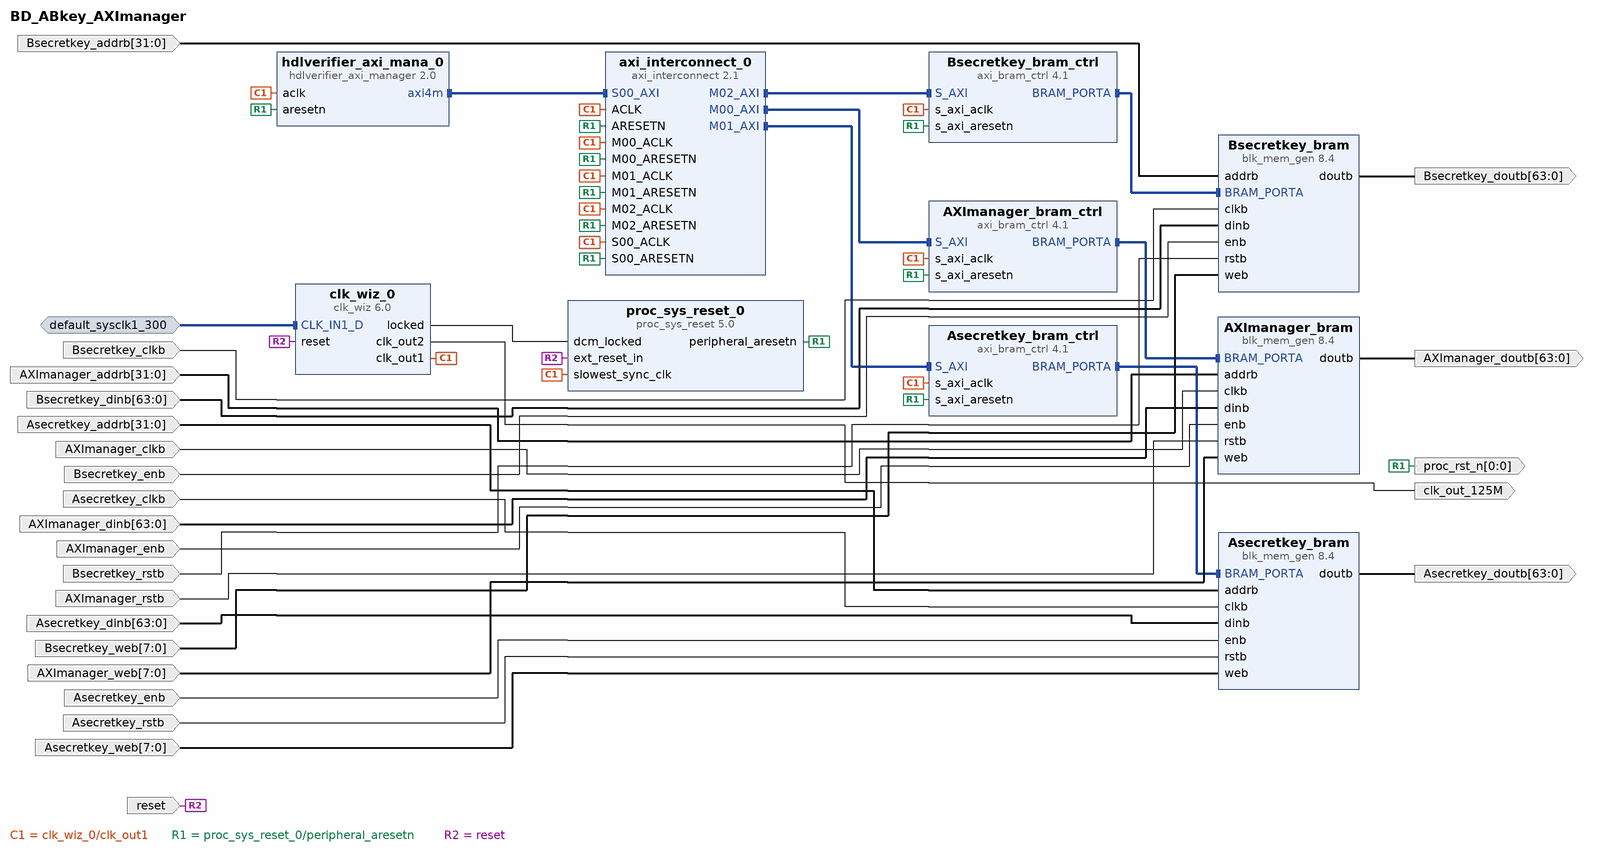
[diagram p0: block diagram of the top level]
# Vivado block design BD_ABkey_AXImanager, xcku5p-ffvb676-2-e, Vivado 2022.1
create_bd_design BD_ABkey_AXImanager

create_bd_intf_port -mode Slave -vlnv xilinx.com:interface:diff_clock_rtl:1.0 default_sysclk1_300
set_property -dict {CONFIG.FREQ_HZ 300000000} [get_bd_intf_ports default_sysclk1_300]
create_bd_port -dir I -type rst reset
set_property -dict {CONFIG.POLARITY ACTIVE_HIGH} [get_bd_ports reset]
create_bd_port -dir I -from 31 -to 0 AXImanager_addrb
create_bd_port -dir I -type clk AXImanager_clkb
create_bd_port -dir I -from 63 -to 0 AXImanager_dinb
create_bd_port -dir O -from 63 -to 0 AXImanager_doutb
create_bd_port -dir I AXImanager_enb
create_bd_port -dir I -type rst AXImanager_rstb
create_bd_port -dir I -from 7 -to 0 AXImanager_web
create_bd_port -dir O -type clk clk_out_125M
create_bd_port -dir O -from 0 -to 0 -type rst proc_rst_n
create_bd_port -dir I -type rst Asecretkey_rstb
create_bd_port -dir I -from 31 -to 0 Asecretkey_addrb
create_bd_port -dir I -from 63 -to 0 Asecretkey_dinb
create_bd_port -dir I -type clk Asecretkey_clkb
create_bd_port -dir I Asecretkey_enb
create_bd_port -dir O -from 63 -to 0 Asecretkey_doutb
create_bd_port -dir I -from 7 -to 0 Asecretkey_web
create_bd_port -dir I -type rst Bsecretkey_rstb
create_bd_port -dir O -from 63 -to 0 Bsecretkey_doutb
create_bd_port -dir I Bsecretkey_enb
create_bd_port -dir I -type clk Bsecretkey_clkb
create_bd_port -dir I -from 63 -to 0 Bsecretkey_dinb
create_bd_port -dir I -from 31 -to 0 Bsecretkey_addrb
create_bd_port -dir I -from 7 -to 0 Bsecretkey_web

create_bd_cell -type ip -vlnv mathworks.com:ip:hdlverifier_axi_manager:2.0 hdlverifier_axi_mana_0
set_property -dict {CONFIG.AXI_ADDR_WIDTH 32 CONFIG.AXI_DATA_WIDTH 64} [get_bd_cells hdlverifier_axi_mana_0]
create_bd_cell -type ip -vlnv xilinx.com:ip:clk_wiz:6.0 clk_wiz_0
set_property -dict [list \
  CONFIG.CLKIN1_JITTER_PS 33.330000000000005 \
  CONFIG.CLKOUT1_DRIVES Buffer \
  CONFIG.CLKOUT1_JITTER 106.400 \
  CONFIG.CLKOUT1_PHASE_ERROR 84.520 \
  CONFIG.CLKOUT1_REQUESTED_OUT_FREQ 125.000 \
  CONFIG.CLKOUT2_DRIVES Buffer \
  CONFIG.CLKOUT2_JITTER 106.400 \
  CONFIG.CLKOUT2_PHASE_ERROR 84.520 \
  CONFIG.CLKOUT2_REQUESTED_OUT_FREQ 125.000 \
  CONFIG.CLKOUT2_USED true \
  CONFIG.CLKOUT3_DRIVES Buffer \
  CONFIG.CLKOUT4_DRIVES Buffer \
  CONFIG.CLKOUT5_DRIVES Buffer \
  CONFIG.CLKOUT6_DRIVES Buffer \
  CONFIG.CLKOUT7_DRIVES Buffer \
  CONFIG.CLK_IN1_BOARD_INTERFACE default_sysclk1_300 \
  CONFIG.FEEDBACK_SOURCE FDBK_AUTO \
  CONFIG.MMCM_BANDWIDTH OPTIMIZED \
  CONFIG.MMCM_CLKFBOUT_MULT_F 12.500 \
  CONFIG.MMCM_CLKIN1_PERIOD 3.333 \
  CONFIG.MMCM_CLKIN2_PERIOD 10.0 \
  CONFIG.MMCM_CLKOUT0_DIVIDE_F 10.000 \
  CONFIG.MMCM_CLKOUT1_DIVIDE 10 \
  CONFIG.MMCM_COMPENSATION AUTO \
  CONFIG.MMCM_DIVCLK_DIVIDE 3 \
  CONFIG.NUM_OUT_CLKS 2 \
  CONFIG.OPTIMIZE_CLOCKING_STRUCTURE_EN true \
  CONFIG.PRIMITIVE MMCM \
  CONFIG.PRIM_IN_FREQ 300.000 \
  CONFIG.PRIM_SOURCE Differential_clock_capable_pin \
  CONFIG.RESET_BOARD_INTERFACE reset \
  CONFIG.RESET_PORT reset \
  CONFIG.RESET_TYPE ACTIVE_HIGH \
  CONFIG.USE_BOARD_FLOW true \
  CONFIG.USE_RESET true \
] [get_bd_cells clk_wiz_0]
create_bd_cell -type ip -vlnv xilinx.com:ip:proc_sys_reset:5.0 proc_sys_reset_0
set_property -dict {CONFIG.RESET_BOARD_INTERFACE reset CONFIG.USE_BOARD_FLOW true} [get_bd_cells proc_sys_reset_0]
create_bd_cell -type ip -vlnv xilinx.com:ip:axi_interconnect:2.1 axi_interconnect_0
set_property -dict [list \
  CONFIG.M00_HAS_DATA_FIFO 1 \
  CONFIG.M00_HAS_REGSLICE 4 \
  CONFIG.M01_HAS_DATA_FIFO 1 \
  CONFIG.M01_HAS_REGSLICE 4 \
  CONFIG.M02_HAS_DATA_FIFO 1 \
  CONFIG.M02_HAS_REGSLICE 4 \
  CONFIG.M03_HAS_DATA_FIFO 1 \
  CONFIG.M03_HAS_REGSLICE 3 \
  CONFIG.M04_HAS_DATA_FIFO 1 \
  CONFIG.M05_HAS_DATA_FIFO 1 \
  CONFIG.M06_HAS_DATA_FIFO 1 \
  CONFIG.NUM_MI 3 \
  CONFIG.S00_HAS_DATA_FIFO 1 \
  CONFIG.S00_HAS_REGSLICE 4 \
] [get_bd_cells axi_interconnect_0]
create_bd_cell -type ip -vlnv xilinx.com:ip:axi_bram_ctrl:4.1 AXImanager_bram_ctrl
set_property -dict [list \
  CONFIG.DATA_WIDTH 64 \
  CONFIG.RD_CMD_OPTIMIZATION 1 \
  CONFIG.SINGLE_PORT_BRAM 1 \
] [get_bd_cells AXImanager_bram_ctrl]
create_bd_cell -type ip -vlnv xilinx.com:ip:blk_mem_gen:8.4 AXImanager_bram
set_property -dict [list \
  CONFIG.Enable_B Use_ENB_Pin \
  CONFIG.Memory_Type True_Dual_Port_RAM \
  CONFIG.Port_B_Clock 100 \
  CONFIG.Port_B_Enable_Rate 100 \
  CONFIG.Port_B_Write_Rate 50 \
  CONFIG.Use_RSTB_Pin true \
] [get_bd_cells AXImanager_bram]
create_bd_cell -type ip -vlnv xilinx.com:ip:axi_bram_ctrl:4.1 Asecretkey_bram_ctrl
set_property -dict [list \
  CONFIG.DATA_WIDTH 64 \
  CONFIG.RD_CMD_OPTIMIZATION 1 \
  CONFIG.SINGLE_PORT_BRAM 1 \
] [get_bd_cells Asecretkey_bram_ctrl]
create_bd_cell -type ip -vlnv xilinx.com:ip:axi_bram_ctrl:4.1 Bsecretkey_bram_ctrl
set_property -dict [list \
  CONFIG.DATA_WIDTH 64 \
  CONFIG.RD_CMD_OPTIMIZATION 1 \
  CONFIG.SINGLE_PORT_BRAM 1 \
] [get_bd_cells Bsecretkey_bram_ctrl]
create_bd_cell -type ip -vlnv xilinx.com:ip:blk_mem_gen:8.4 Asecretkey_bram
set_property -dict {CONFIG.Memory_Type True_Dual_Port_RAM} [get_bd_cells Asecretkey_bram]
create_bd_cell -type ip -vlnv xilinx.com:ip:blk_mem_gen:8.4 Bsecretkey_bram
set_property -dict [list \
  CONFIG.Enable_B Use_ENB_Pin \
  CONFIG.Memory_Type True_Dual_Port_RAM \
  CONFIG.Port_B_Clock 100 \
  CONFIG.Port_B_Enable_Rate 100 \
  CONFIG.Port_B_Write_Rate 50 \
  CONFIG.Use_RSTB_Pin true \
] [get_bd_cells Bsecretkey_bram]

# ---- connections ----

connect_bd_intf_net -intf_net axi_bram_ctrl_0_BRAM_PORTA [get_bd_intf_pins Asecretkey_bram_ctrl/BRAM_PORTA] [get_bd_intf_pins Asecretkey_bram/BRAM_PORTA]
connect_bd_intf_net -intf_net axi_bram_ctrl_1_BRAM_PORTA [get_bd_intf_pins Bsecretkey_bram_ctrl/BRAM_PORTA] [get_bd_intf_pins Bsecretkey_bram/BRAM_PORTA]
connect_bd_intf_net -intf_net axi_bram_ctrl_BRAM_PORTA [get_bd_intf_pins AXImanager_bram_ctrl/BRAM_PORTA] [get_bd_intf_pins AXImanager_bram/BRAM_PORTA]
connect_bd_intf_net [get_bd_intf_pins axi_interconnect_0/M00_AXI] [get_bd_intf_pins AXImanager_bram_ctrl/S_AXI]
connect_bd_intf_net [get_bd_intf_pins axi_interconnect_0/M01_AXI] [get_bd_intf_pins Asecretkey_bram_ctrl/S_AXI]
connect_bd_intf_net [get_bd_intf_pins axi_interconnect_0/M02_AXI] [get_bd_intf_pins Bsecretkey_bram_ctrl/S_AXI]
connect_bd_intf_net -intf_net default_sysclk1_300_1 [get_bd_intf_ports default_sysclk1_300] [get_bd_intf_pins clk_wiz_0/CLK_IN1_D]
connect_bd_intf_net [get_bd_intf_pins hdlverifier_axi_mana_0/axi4m] [get_bd_intf_pins axi_interconnect_0/S00_AXI]
connect_bd_net [get_bd_pins AXImanager_bram/doutb] [get_bd_ports AXImanager_doutb]
connect_bd_net -net Asiftedkey_bram_doutb [get_bd_pins Asecretkey_bram/doutb] [get_bd_ports Asecretkey_doutb]
connect_bd_net -net Bsiftedkey_bram_doutb [get_bd_pins Bsecretkey_bram/doutb] [get_bd_ports Bsecretkey_doutb]
connect_bd_net -net addrb_0_1 [get_bd_ports AXImanager_addrb] [get_bd_pins AXImanager_bram/addrb]
connect_bd_net -net addrb_0_2 [get_bd_ports Asecretkey_addrb] [get_bd_pins Asecretkey_bram/addrb]
connect_bd_net -net addrb_0_3 [get_bd_ports Bsecretkey_addrb] [get_bd_pins Bsecretkey_bram/addrb]
connect_bd_net [get_bd_pins clk_wiz_0/clk_out1] \
  [get_bd_pins hdlverifier_axi_mana_0/aclk] [get_bd_pins axi_interconnect_0/S00_ACLK] \
  [get_bd_pins proc_sys_reset_0/slowest_sync_clk] [get_bd_pins axi_interconnect_0/M00_ACLK] \
  [get_bd_pins axi_interconnect_0/ACLK] [get_bd_pins AXImanager_bram_ctrl/s_axi_aclk] \
  [get_bd_pins Asecretkey_bram_ctrl/s_axi_aclk] [get_bd_pins axi_interconnect_0/M01_ACLK] \
  [get_bd_pins Bsecretkey_bram_ctrl/s_axi_aclk] [get_bd_pins axi_interconnect_0/M02_ACLK]
connect_bd_net [get_bd_pins clk_wiz_0/clk_out2] [get_bd_ports clk_out_125M]
connect_bd_net [get_bd_pins clk_wiz_0/locked] [get_bd_pins proc_sys_reset_0/dcm_locked]
connect_bd_net -net clkb_0_1 [get_bd_ports AXImanager_clkb] [get_bd_pins AXImanager_bram/clkb]
connect_bd_net -net clkb_0_2 [get_bd_ports Asecretkey_clkb] [get_bd_pins Asecretkey_bram/clkb]
connect_bd_net -net clkb_0_3 [get_bd_ports Bsecretkey_clkb] [get_bd_pins Bsecretkey_bram/clkb]
connect_bd_net -net dinb_0_1 [get_bd_ports AXImanager_dinb] [get_bd_pins AXImanager_bram/dinb]
connect_bd_net -net dinb_0_2 [get_bd_ports Asecretkey_dinb] [get_bd_pins Asecretkey_bram/dinb]
connect_bd_net -net dinb_0_3 [get_bd_ports Bsecretkey_dinb] [get_bd_pins Bsecretkey_bram/dinb]
connect_bd_net -net enb_0_1 [get_bd_ports AXImanager_enb] [get_bd_pins AXImanager_bram/enb]
connect_bd_net -net enb_0_2 [get_bd_ports Asecretkey_enb] [get_bd_pins Asecretkey_bram/enb]
connect_bd_net -net enb_0_3 [get_bd_ports Bsecretkey_enb] [get_bd_pins Bsecretkey_bram/enb]
connect_bd_net [get_bd_pins proc_sys_reset_0/peripheral_aresetn] \
  [get_bd_pins hdlverifier_axi_mana_0/aresetn] [get_bd_pins axi_interconnect_0/S00_ARESETN] \
  [get_bd_pins axi_interconnect_0/M00_ARESETN] [get_bd_pins axi_interconnect_0/ARESETN] \
  [get_bd_pins AXImanager_bram_ctrl/s_axi_aresetn] [get_bd_ports proc_rst_n] [get_bd_pins Asecretkey_bram_ctrl/s_axi_aresetn] \
  [get_bd_pins axi_interconnect_0/M01_ARESETN] [get_bd_pins Bsecretkey_bram_ctrl/s_axi_aresetn] \
  [get_bd_pins axi_interconnect_0/M02_ARESETN]
connect_bd_net [get_bd_ports reset] [get_bd_pins proc_sys_reset_0/ext_reset_in] [get_bd_pins clk_wiz_0/reset]
connect_bd_net -net rstb_0_1 [get_bd_ports AXImanager_rstb] [get_bd_pins AXImanager_bram/rstb]
connect_bd_net -net rstb_0_2 [get_bd_ports Asecretkey_rstb] [get_bd_pins Asecretkey_bram/rstb]
connect_bd_net -net rstb_0_3 [get_bd_ports Bsecretkey_rstb] [get_bd_pins Bsecretkey_bram/rstb]
connect_bd_net -net web_0_1 [get_bd_ports AXImanager_web] [get_bd_pins AXImanager_bram/web]
connect_bd_net -net web_0_2 [get_bd_ports Asecretkey_web] [get_bd_pins Asecretkey_bram/web]
connect_bd_net -net web_0_3 [get_bd_ports Bsecretkey_web] [get_bd_pins Bsecretkey_bram/web]

# ---- address map ----
assign_bd_address -offset 0x10000000 -range 256K -target_address_space [get_bd_addr_spaces hdlverifier_axi_mana_0/axi4m] [get_bd_addr_segs Asecretkey_bram_ctrl/S_AXI/Mem0]
assign_bd_address -offset 0x20000000 -range 256K -target_address_space [get_bd_addr_spaces hdlverifier_axi_mana_0/axi4m] [get_bd_addr_segs Bsecretkey_bram_ctrl/S_AXI/Mem0]
assign_bd_address -offset 0xC0000000 -range 8K -target_address_space [get_bd_addr_spaces hdlverifier_axi_mana_0/axi4m] [get_bd_addr_segs AXImanager_bram_ctrl/S_AXI/Mem0]

validate_bd_design
save_bd_design
